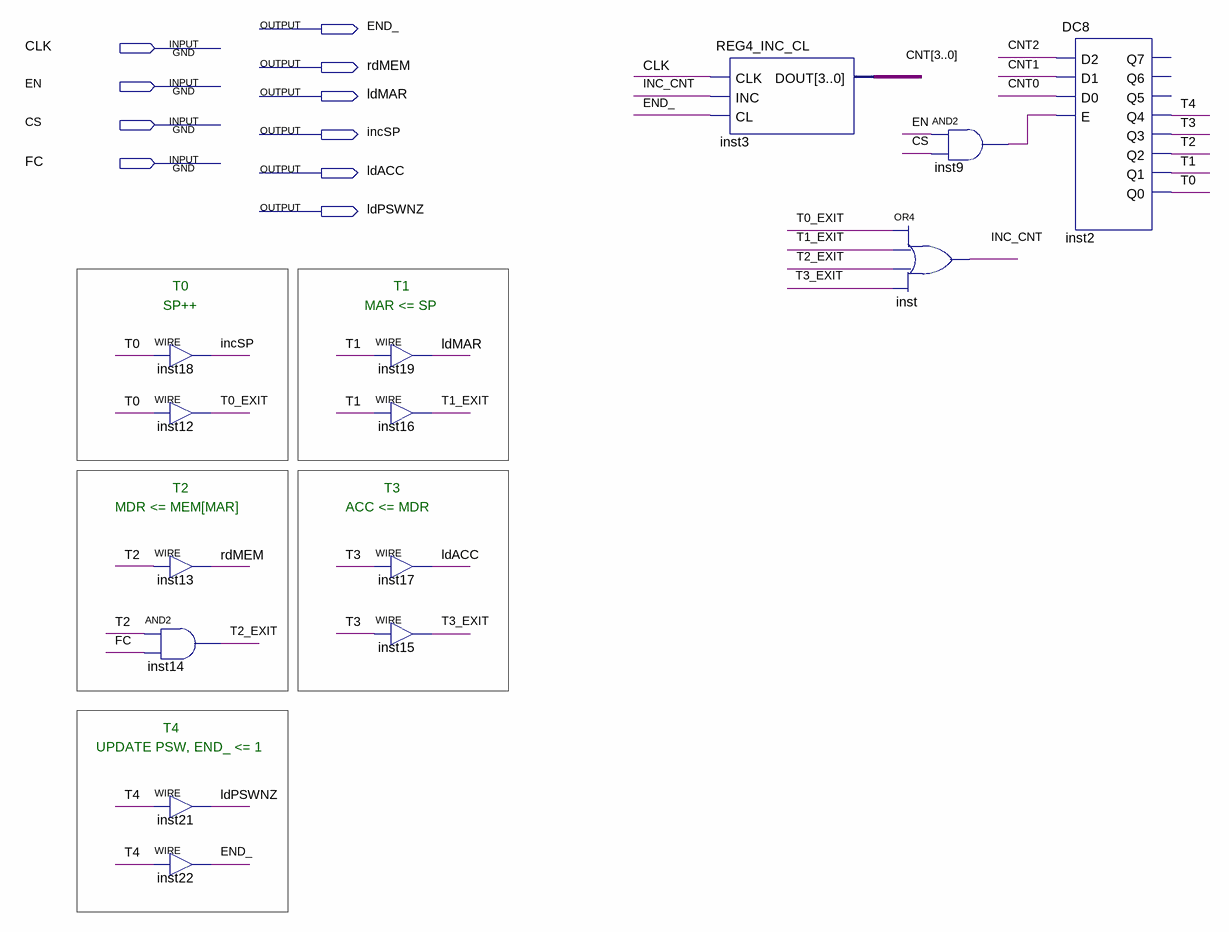
[diagram p0: schematic sheet]
// Quartus schematic PLA.bdf as structural Verilog: 14 symbols, 10 pins
module PLA (
  input  CLK,
  input  EN,
  input  CS,
  input  FC,
  output END_,
  output rdMEM,
  output ldMAR,
  output incSP,
  output ldACC,
  output ldPSWNZ
);

  wire INC_CNT, inst9_out, T0, T0_EXIT, T1, T1_EXIT, T2, T2_EXIT, T3, T3_EXIT, T4;
  wire [3:0] CNT;

  assign incSP = T0;  // WIRE inst18
  assign T0_EXIT = T0;  // WIRE inst12
  assign rdMEM = T2;  // WIRE inst13
  and inst14 (T2_EXIT, T2, FC);
  assign ldPSWNZ = T4;  // WIRE inst21
  assign END_ = T4;  // WIRE inst22
  assign ldMAR = T1;  // WIRE inst19
  assign T1_EXIT = T1;  // WIRE inst16
  assign ldACC = T3;  // WIRE inst17
  assign T3_EXIT = T3;  // WIRE inst15
  REG4_INC_CL inst3 (.CLK(CLK), .INC(INC_CNT), .CL(END_), .DOUT(CNT));
  and inst9 (inst9_out, EN, CS);
  or inst (INC_CNT, T0_EXIT, T1_EXIT, T2_EXIT, T3_EXIT);
  DC8 inst2 (
    .D2(CNT[2]), .D1(CNT[1]), .D0(CNT[0]), .E(inst9_out), .Q4(T4), .Q3(T3), .Q2(T2), .Q1(T1), .Q0(T0));  // open: Q7, Q6, Q5

  // Notes on the sheet:
  //   T0
  //   T1
  //   SP++
  //   MAR <= SP
  //   T2
  //   T3
  //   MDR <= MEM[MAR] 
  //   ACC <= MDR
  //   T4
  //   UPDATE PSW, END_ <= 1
endmodule
